# Altium schematic sheet HV_Amp_Discrete.SchDoc: Power
size 420 x 297 mm; Author: G.Kasprowicz; CompanyName: WUT ISE; DrawnBy: G.Kasprowicz; Organization: WUT ISE; Address1: PW ISE; Address2: Nowowiejska 15/19 00-665 Warsaw; Address3: gkasprow@gmail.com; DocumentNumber: 2; Revision: 2; SheetNumber: 2; SheetTotal: 5; ModifiedBy: -; CheckedDate: -; Title2: Stage; DivGrp: WUT ISE; Designer: G.Kasprowicz; ModifiedDate: -; ProjectName: Sensor Box
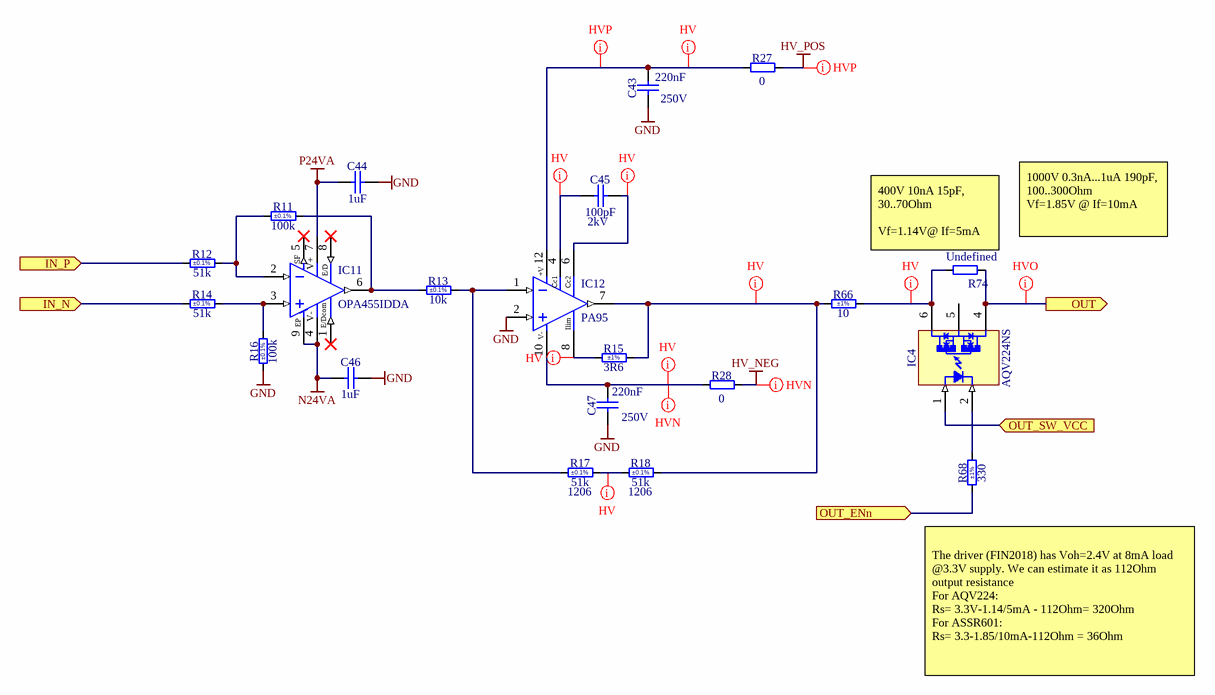
[diagram p0: HV_Amp_Discrete.SchDoc]

## Parts
C43  220nF  Voltage: 250V  [CAPC4532X165N]
C44  1uF  [CAPC1608X87N]
C45  100pF  Voltage: 2kV  [CAPC4620X203N]
C46  1uF  [CAPC1608X87N]
C47  220nF  Voltage: 250V  [CAPC4532X165N]
IC4  AQV224NS  [PANASONIC_AQV22(SOP)]
IC11  OPA455IDDA  [SOIC127P600X170-9N-R249X300]
IC12  PA95  [APEX_PA95_hflip]
R11  100k  Tolerance: ±0.1%  [RESC1608X55N]
R12  51k  Tolerance: ±0.1%  [RESC2012X60N]
R13  10k  Tolerance: ±0.1%  [RESC1608X64N]
R14  51k  Tolerance: ±0.1%  [RESC2012X60N]
R15  3R6  Tolerance: ±1%  [RESC1608X55N]
R16  100k  Tolerance: ±0.1%  [RESC1608X55N]
R17  51k  Tolerance: ±0.1%  Case: 1206  [RESC3216X65N]
R18  51k  Tolerance: ±0.1%  Case: 1206  [RESC3216X65N]
R27  0  [RESC1608X55N]
R28  0  [RESC1608X55N]
R66  10  Tolerance: ±1%  [RESC3216X65N]
R68  330  Tolerance: ±1%  [RESC1005X40N]
R74  Undefined  [RESC3216X65N]

## Ports
IN_N (in), IN_P (in), OUT (out), OUT_ENn (in), OUT_SW_VCC (in)

## Nets
GND: C43.1 C44.2 C46.2 C47.1 IC12.2(IN+) R16.1
HV_NEG: R28.2
HV_POS: R27.2
N24VA: C46.1 IC11.4(V-) IC11.9(Exposed_Pad)
P24VA: C44.1 IC11.7(V+)
IN_N: R14.1 ; port IN_N
IN_P: R12.1 ; port IN_P
OUT: IC4.4 R74.2 ; port OUT
OUT_ENn: R68.1 ; port OUT_ENn
OUT_SW_VCC: IC4.1(A) ; port OUT_SW_VCC
NetC43_2: C43.2 IC12.12(+Vs) R27.1
NetC45_1: C45.1 IC12.4(Cc1)
NetC45_2: C45.2 IC12.6(Cc2)
NetC47_2: C47.2 IC12.10(-Vs) R28.1
NetIC4_2: IC4.2(K) R68.2
NetIC4_6: IC4.6 R66.2 R74.1
NetIC11_2: IC11.2(IN-) R11.1 R12.2
NetIC11_3: IC11.3(IN+) R14.2 R16.2
NetIC11_6: IC11.6(OUT) R11.2 R13.1
NetIC12_1: IC12.1(IN-) R13.2 R17.1
NetIC12_7: IC12.7(OUT) R15.2 R18.2 R66.1
NetIC12_8: IC12.8(ILIM) R15.1
NetR17_2: R17.2 R18.1

Not connected (* = marked no-connect by the designer): IC4 5; IC11 1(E/Dcommon)* 5(Status_Flag)* 8(E/B)*

## Layout directives
net class HV: NetC43_2, NetC45_1, NetC45_2, NetC47_2, NetIC4_6, NetIC12_7, NetIC12_8, NetR17_2
net class HVP: HV_POS, NetC43_2
net class HVN: HV_NEG, NetC47_2
net class HVO: OUT

## Notes on the sheet
- (near R74) 400V 10nA 15pF, 30..70Ohm
  Vf=1.14V@ If=5mA
- (near R74) 1000V 0.3nA...1uA 190pF, 100..300Ohm
  Vf=1.85V @ If=10mA
- (near R68) The driver (FIN2018) has Voh=2.4V at 8mA load @3.3V supply. We can estimate it as 112Ohm output resistance
  For AQV224:
  Rs= 3.3V-1.14/5mA - 112Ohm= 320Ohm
  For ASSR601:
  Rs= 3.3-1.85/10mA-112Ohm = 36Ohm
- Project/Equipment
- Document
- Designer
- Drawn by
- Check.by
- Copyright WUT ISE 2020.
  This documentation describes Open Hardware and is licensed under the CERN OHL v.1.2. You may redistribute and modify this documentation under the terms of the CERN OHL v.1.2. (http://ohwr.org/CERNOHL). This documentation is distributed WITHOUT ANY EXPRESS OR IMPLIED WARRANTY, INCLUDING OF MERCHANTABILITY, SATISFACTORY QUALITY AND FITNESS FOR A PARTICULAR PURPOSE. Please see the CERN OHL v.1.2 for applicable conditions.
- Contact
- File
- Last Mod.
- Print Date
- Sheet
- Size
- A3
- of
- Rev
- (in symbol OA_OPA455) SF; E/D; E/Dcom; EP
- (in symbol OA_PA95) +V; V-; Ilim

## Library data of the parts
C43 C47 = CC1812_220NF_250V_10%_X7R_FT-CAP: Non-polarised capacitor; Part Description: Flexible Termination System (FT-CAP) SMD Multilayer Ceramic  Chip Capacitor; Manufacturer: KEMET; Manufacturer Part Number: C1812X224KARACTU; TC: X7R; Tolerance: ±10%; Part Number: CC1812_220NF_250V_10%_X7R_FT-CAP; Component Kind: Standard; Component Type: Standard; Pin Count: 2; Value: 220nF; Status: None; Case: 1812; Mounted: Yes; Socket: No; SMD: Yes; Sense: No; ComponentHeight: 1.65mm; HelpURL: \\cern.ch\dfs\Applications\Altium\Datasheets\CC1812_X7R_KEMET_FT-CAP.pdf; Author: CERN DEM JLC; CreateDate: 09.08.2018; LatestRevisionDate: 09.08.2018
C44 C46 = CC0603_1UF_50V_10%_X5R: Non-polarised capacitor; Part Description: SMD Multilayer Chip Ceramic Capacitor; Manufacturer: GENERIC; Manufacturer1 Part Number: C1608X5R1H105K080; Voltage: 50V; TC: X5R; Tolerance: ±10%; Part Number: CC0603_1UF_50V_10%_X5R; Component Kind: Standard; Component Type: Standard; Pin Count: 2; Value: 1uF; Status: None; Manufacturer Part Number: CC0603_1UF_50V_10%_X5R; Case: 0603; Mounted: Yes; Socket: No; SMD: Yes; Sense: No; Manufacturer1 Example: TDK; Manufacturer1 ComponentHeight: 0.9mm; HelpURL: \\cern.ch\dfs\Applications\Altium\Datasheets\CC0603_X5R_TDK_C.pdf; Author: CERN DEM JMW; CreateDate: 09.11.2015; LatestRevisionDate: 09.11.2015
C45 = CC1808_100PF_2KV_5%_C0G: Non-polarised capacitor; Part Description: High Voltage MLC Chip Capacitor; Manufacturer: GENERIC; Manufacturer1 Part Number: 1808GA101JAT1A; TC: C0G/NP0; Tolerance: ±5%; Part Number: CC1808_100PF_2KV_5%_C0G; Component Kind: Standard; Component Type: Standard; Pin Count: 2; Value: 100pF; Status: None; Manufacturer Part Number: CC1808_100PF_2KV_5%_C0G; Case: 1808; Mounted: Yes; Socket: No; SMD: Yes; Sense: No; Manufacturer1 Example: AVX; Manufacturer1 ComponentHeight: 2.03mm; HelpURL: \\cern.ch\dfs\Applications\Altium\Datasheets\CC1808_C0G_AVX_HV-MLC.pdf; Author: CERN DEM JLC; CreateDate: 25.11.2014; LatestRevisionDate: 16.11.2017
IC4 = OPTOMOS_AQV224NS: PhotoMOS Relay 400V 40mA; Part Description: GU SOP 1 Form A, PhotoMOS Relay, 400V 40mA; Manufacturer: PANASONIC; PressFit: No; Bonding: No; Part Number: AQV224NS; Component Kind: Standard; Component Type: Standard; Device: AQV224NS; Footprint: PANASONIC_AQV224NS; PackageDescription: PANASONIC Serie AQV21(SOP), 2.54mm Pitch; 6 Pin, 4.40mm W X 6.30mm L X 2.30mm H body; Manufacturer Part Number: AQV224NS; Pin Count: 6; Case: SOP6; Mounted: Yes; Socket: No; SMD: Yes; Sense: No; ComponentHeight: 2.3mm; HelpURL: \\cern.ch\dfs\Applications\Altium\Datasheets\AQV212S.pdf; ComponentLink1Description: Package Drawing; ComponentLink1URL: \\cern.ch\dfs\Applications\Altium\Datasheets\AQV21_Package-Drawing.pdf; Author: GK; CreateDate: 03.09.2010; LatestRevisionDate: 04.12.2018
IC11 = OA_OPA455: High-Voltage (150V), High-Current (50mA) Operational Amplifier, G=1 Stable; Manufacturer: TEXAS INSTRUMENTS; PressFit: No; Bonding: No; Part Number: OPA455IDDA; Component Kind: Standard; Component Type: Standard; Device: OPA455IDDA; PackageDescription: SOIC, 1.27mm Pitch; 8 Pin, 4.00mm W X 5.00mm L X 1.70mm H body (w/Thermal Tab 2.49 X 3.00mm), IPC Medium Density; Part Description: High-Voltage (150V), High-Current (50mA) Operational Amplifier, G=1 Stable; Manufacturer Part Number: OPA455IDDA; Pin Count: 9; Case: SOIC8; Mounted: Yes; Socket: No; SMD: Yes; Sense: No; ComponentHeight: 1.70mm; Author: GK; HelpURL: \\cern.ch\dfs\Applications\Altium\Datasheets\OPA454AIDDA.pdf; CreateDate: 23.05.2011; LatestRevisionDate: 23.05.2011
IC12 = OA_PA95: High Voltage Power Operational Amplifier; Part Number: PA95_hflip; Part Description: 100mA 900V High Voltage Power Operational Amplifier (DQ Case Style); Manufacturer: APEX; PressFit: No; Bonding: No; Component Kind: Standard; Component Type: Standard; Device: PA95; PackageDescription: Power SIP, DQ Package Style, Pitch 2.54mm, Reverse Right Angle Formed Original Straight Leads For Flipped  Horizontal Mount; Manufacturer Part Number: PA95; Pin Count: 8; Mounted: Yes; Socket: No; SMD: No; Sense: No; ComponentHeight: 10mm; Author: GK; HelpURL: \\cern.ch\dfs\Applications\Altium\Datasheets\PA94.pdf; ComponentLink1URL: \\cern.ch\dfs\Applications\Altium\Datasheets\PA94_v_Package.pdf; ComponentLink1Description: Package Drawing; CreateDate: 04.12.2008; LatestRevisionDate: 12.01.2010
R11 R16 = R0603_100K_0.1%_0.063W_10PPM: Resistor - 0.1%; Part Description: Thin Film Chip Resistor; Manufacturer: GENERIC; Manufacturer1 Part Number: RN73C1J100KBTDF; Power: 0.063W; TC: ±10ppm; PressFit: No; Part Number: R0603_100K_0.1%_0.063W_10PPM; Component Kind: Standard; Component Type: Standard; Pin Count: 2; Value: 100k; Status: Not Recommended; Manufacturer Part Number: R0603_100K_0.1%_0.063W_10PPM; Case: 0603; Mounted: Yes; Sense: No; Socket: No; SMD: Yes; Manufacturer1 Example: TYCO HOLSWORTHY; Manufacturer1 ComponentHeight: 0.55mm; HelpURL: \\cern.ch\dfs\Applications\Altium\Datasheets\R0603_Tyco_RN73.pdf; Author: CERN DEM JLC; CreateDate: 03.12.2007; LatestRevisionDate: 13.03.2008
R12 R14 = R0805_51K_0.1%_0.125W_10PPM: Resistor - 0.1%; Part Description: Thin Film Chip Resistor; Manufacturer: GENERIC; Manufacturer1 Part Number: ERA6ARB513V; Power: 0.125W; TC: ±10ppm; PressFit: No; Part Number: R0805_51K_0.1%_0.125W_10PPM; Component Kind: Standard; Component Type: Standard; Pin Count: 2; Value: 51k; Status: Not Recommended; Manufacturer Part Number: R0805_51K_0.1%_0.125W_10PPM; Case: 0805; Mounted: Yes; Sense: No; Socket: No; SMD: Yes; Manufacturer1 Example: PANASONIC; Manufacturer1 ComponentHeight: 0.6mm; HelpURL: \\cern.ch\dfs\Applications\Altium\Datasheets\R0805_PANASONIC_ERA.pdf; Author: CERN DEM BC; CreateDate: 26.09.2019; LatestRevisionDate: 26.09.2019
R13 = R0603_10K_0.1%_0.1W_25PPM: Resistor - 0.1%; Part Description: Thin Film Chip Resistor; Manufacturer: GENERIC; Manufacturer1 Part Number: ERA3AEB103V; Power: 0.1W; TC: ±25ppm/°C; PressFit: No; Part Number: R0603_10K_0.1%_0.1W_25PPM; Component Kind: Standard; Component Type: Standard; Pin Count: 2; Value: 10k; Status: Not Recommended; Manufacturer Part Number: R0603_10K_0.1%_0.1W_25PPM; Case: 0603; Mounted: Yes; Sense: No; Socket: No; SMD: Yes; Manufacturer1 Example: PANASONIC; Manufacturer1 ComponentHeight: 0.55mm; HelpURL: \\cern.ch\dfs\Applications\Altium\Datasheets\R0603_PANASONIC_ERA.pdf; Author: CERN DEM JMW; CreateDate: 09.11.2015; LatestRevisionDate: 11.01.2017
R15 = R0603_3R6_1%_0.1W_200PPM: Resistor - 1%; Part Description: General Purpose Thick Film Chip Resistor; Manufacturer: GENERIC; Manufacturer1 Part Number: 232270463608L or RC0603FR-073R6L; Power: 0.1W; TC: ±200ppm/°C; PressFit: No; Part Number: R0603_3R6_1%_0.1W_200PPM; Component Kind: Standard; Component Type: Standard; Pin Count: 2; Value: 3R6; Status: Preferred; Manufacturer Part Number: R0603_3R6_1%_0.1W_200PPM; Case: 0603; Mounted: Yes; Sense: No; Socket: No; SMD: Yes; Manufacturer1 Example: YAGEO PHYCOMP; Manufacturer1 ComponentHeight: 0.65mm; HelpURL: \\cern.ch\dfs\Applications\Altium\Datasheets\R0603_Phycomp_RC0603.pdf; Author: CERN DEM JLC; CreateDate: 03.12.2007; LatestRevisionDate: 17.10.2012
R17 R18 = R1206_51K_0.1%_0.25W_25PPM: Resistor - 0.1%; Part Description: Thin Film Chip Resistor; Manufacturer: GENERIC; Manufacturer1 Part Number: RN73H2BTTD5102B25; Power: 0.25W; TC: ±25ppm/°C; PressFit: No; Part Number: R1206_51K_0.1%_0.25W_25PPM; Component Kind: Standard; Component Type: Standard; Pin Count: 2; Value: 51k; Status: Not Recommended; Manufacturer Part Number: R1206_51K_0.1%_0.25W_25PPM; Mounted: Yes; Sense: No; Socket: No; SMD: Yes; Manufacturer1 Example: KOA; Manufacturer1 ComponentHeight: 0.70mm; HelpURL: \\cern.ch\dfs\Applications\Altium\Datasheets\R1206_KOA_RN73H.pdf; Author: CERN DEM JLC; CreateDate: 03.12.2007; LatestRevisionDate: 13.03.2008
R27 R28 = R0603_0R_JUMPER: Resistor; Part Description: 1A (0.05R Max DC Resistance) Zero Ohm Jumper; Manufacturer: GENERIC; Manufacturer1 Part Number: NRC06Z0; PressFit: No; Part Number: R0603_0R_JUMPER; Component Kind: Standard; Component Type: Standard; Pin Count: 2; Value: 0; Status: Preferred; Manufacturer Part Number: R0603_0R_JUMPER; Case: 0603; Mounted: Yes; Sense: No; Socket: No; SMD: Yes; Manufacturer1 Example: NIC COMPONENT; Manufacturer1 ComponentHeight: 0.55mm; HelpURL: \\cern.ch\dfs\Applications\Altium\Datasheets\R0603_NIC_NRC.pdf; Author: CERN DEM JLC; CreateDate: 03.12.2007; LatestRevisionDate: 13.03.2008
R66 = R1206_10R_1%_0.25W_200PPM: Resistor - 1%; Part Description: General Purpose Thick Film Chip Resistor; Manufacturer: GENERIC; Manufacturer1 Part Number: NRC12F10R0TRF; Power: 0.25W; TC: ±200ppm/°C; PressFit: No; Part Number: R1206_10R_1%_0.25W_200PPM; Component Kind: Standard; Component Type: Standard; Pin Count: 2; Value: 10; Status: Preferred; Manufacturer Part Number: R1206_10R_1%_0.25W_200PPM; Case: 1206; Mounted: Yes; Sense: No; Socket: No; SMD: Yes; Manufacturer1 Example: NIC COMPONENT; Manufacturer1 ComponentHeight: 0.65mm; HelpURL: \\cern.ch\dfs\Applications\Altium\Datasheets\R1206_NIC_NRC.pdf; Author: CERN DEM JLC; CreateDate: 24.06.2009; LatestRevisionDate: 24.06.2009
R68 = R0402_330R_1%_0.0625W_100PPM: Resistor - 1%; Part Description: General Purpose Thick Film Chip Resistor; Manufacturer: GENERIC; Manufacturer1 Part Number: 232270673301L; TC: ±100ppm/°C; PressFit: No; Part Number: R0402_330R_1%_0.0625W_100PPM; Component Kind: Standard; Component Type: Standard; Pin Count: 2; Value: 330; Status: Not Recommended; Power: 0.0625W; Manufacturer Part Number: R0402_330R_1%_0.0625W_100PPM; Case: 0402; Mounted: Yes; Sense: No; Socket: No; SMD: Yes; Manufacturer1 Example: YAGEO PHYCOMP; Manufacturer1 ComponentHeight: 0.4mm; HelpURL: \\cern.ch\dfs\Applications\Altium\Datasheets\R0402_Phycomp_RC0402.pdf; Author: CERN DEM JLC; CreateDate: 03.12.2007; LatestRevisionDate: 17.10.2012
R74 = R1206_NO-VALUE: Resistor; Part Description: Reserved Footprint For a 1206 (3216) Chip Resistor; PressFit: No; Mounted: No; Part Number: R1206_NO-VALUE; Component Kind: Standard; Component Type: Standard; Pin Count: 2; Value: Undefined; Status: None; Manufacturer: Undefined; Manufacturer Part Number: R1206_NO-VALUE; Case: 1206; Sense: No; Socket: No; SMD: Yes; Manufacturer1 Example: Undefined; Manufacturer1 Part Number: Undefined; Manufacturer1 ComponentHeight: Undefined; HelpURL: Undefined; Author: CERN DEM JLC; CreateDate: 03.12.2007; LatestRevisionDate: 13.03.2008